# EAGLE schematic Atmega1284p (EAGLE 8.6.0)
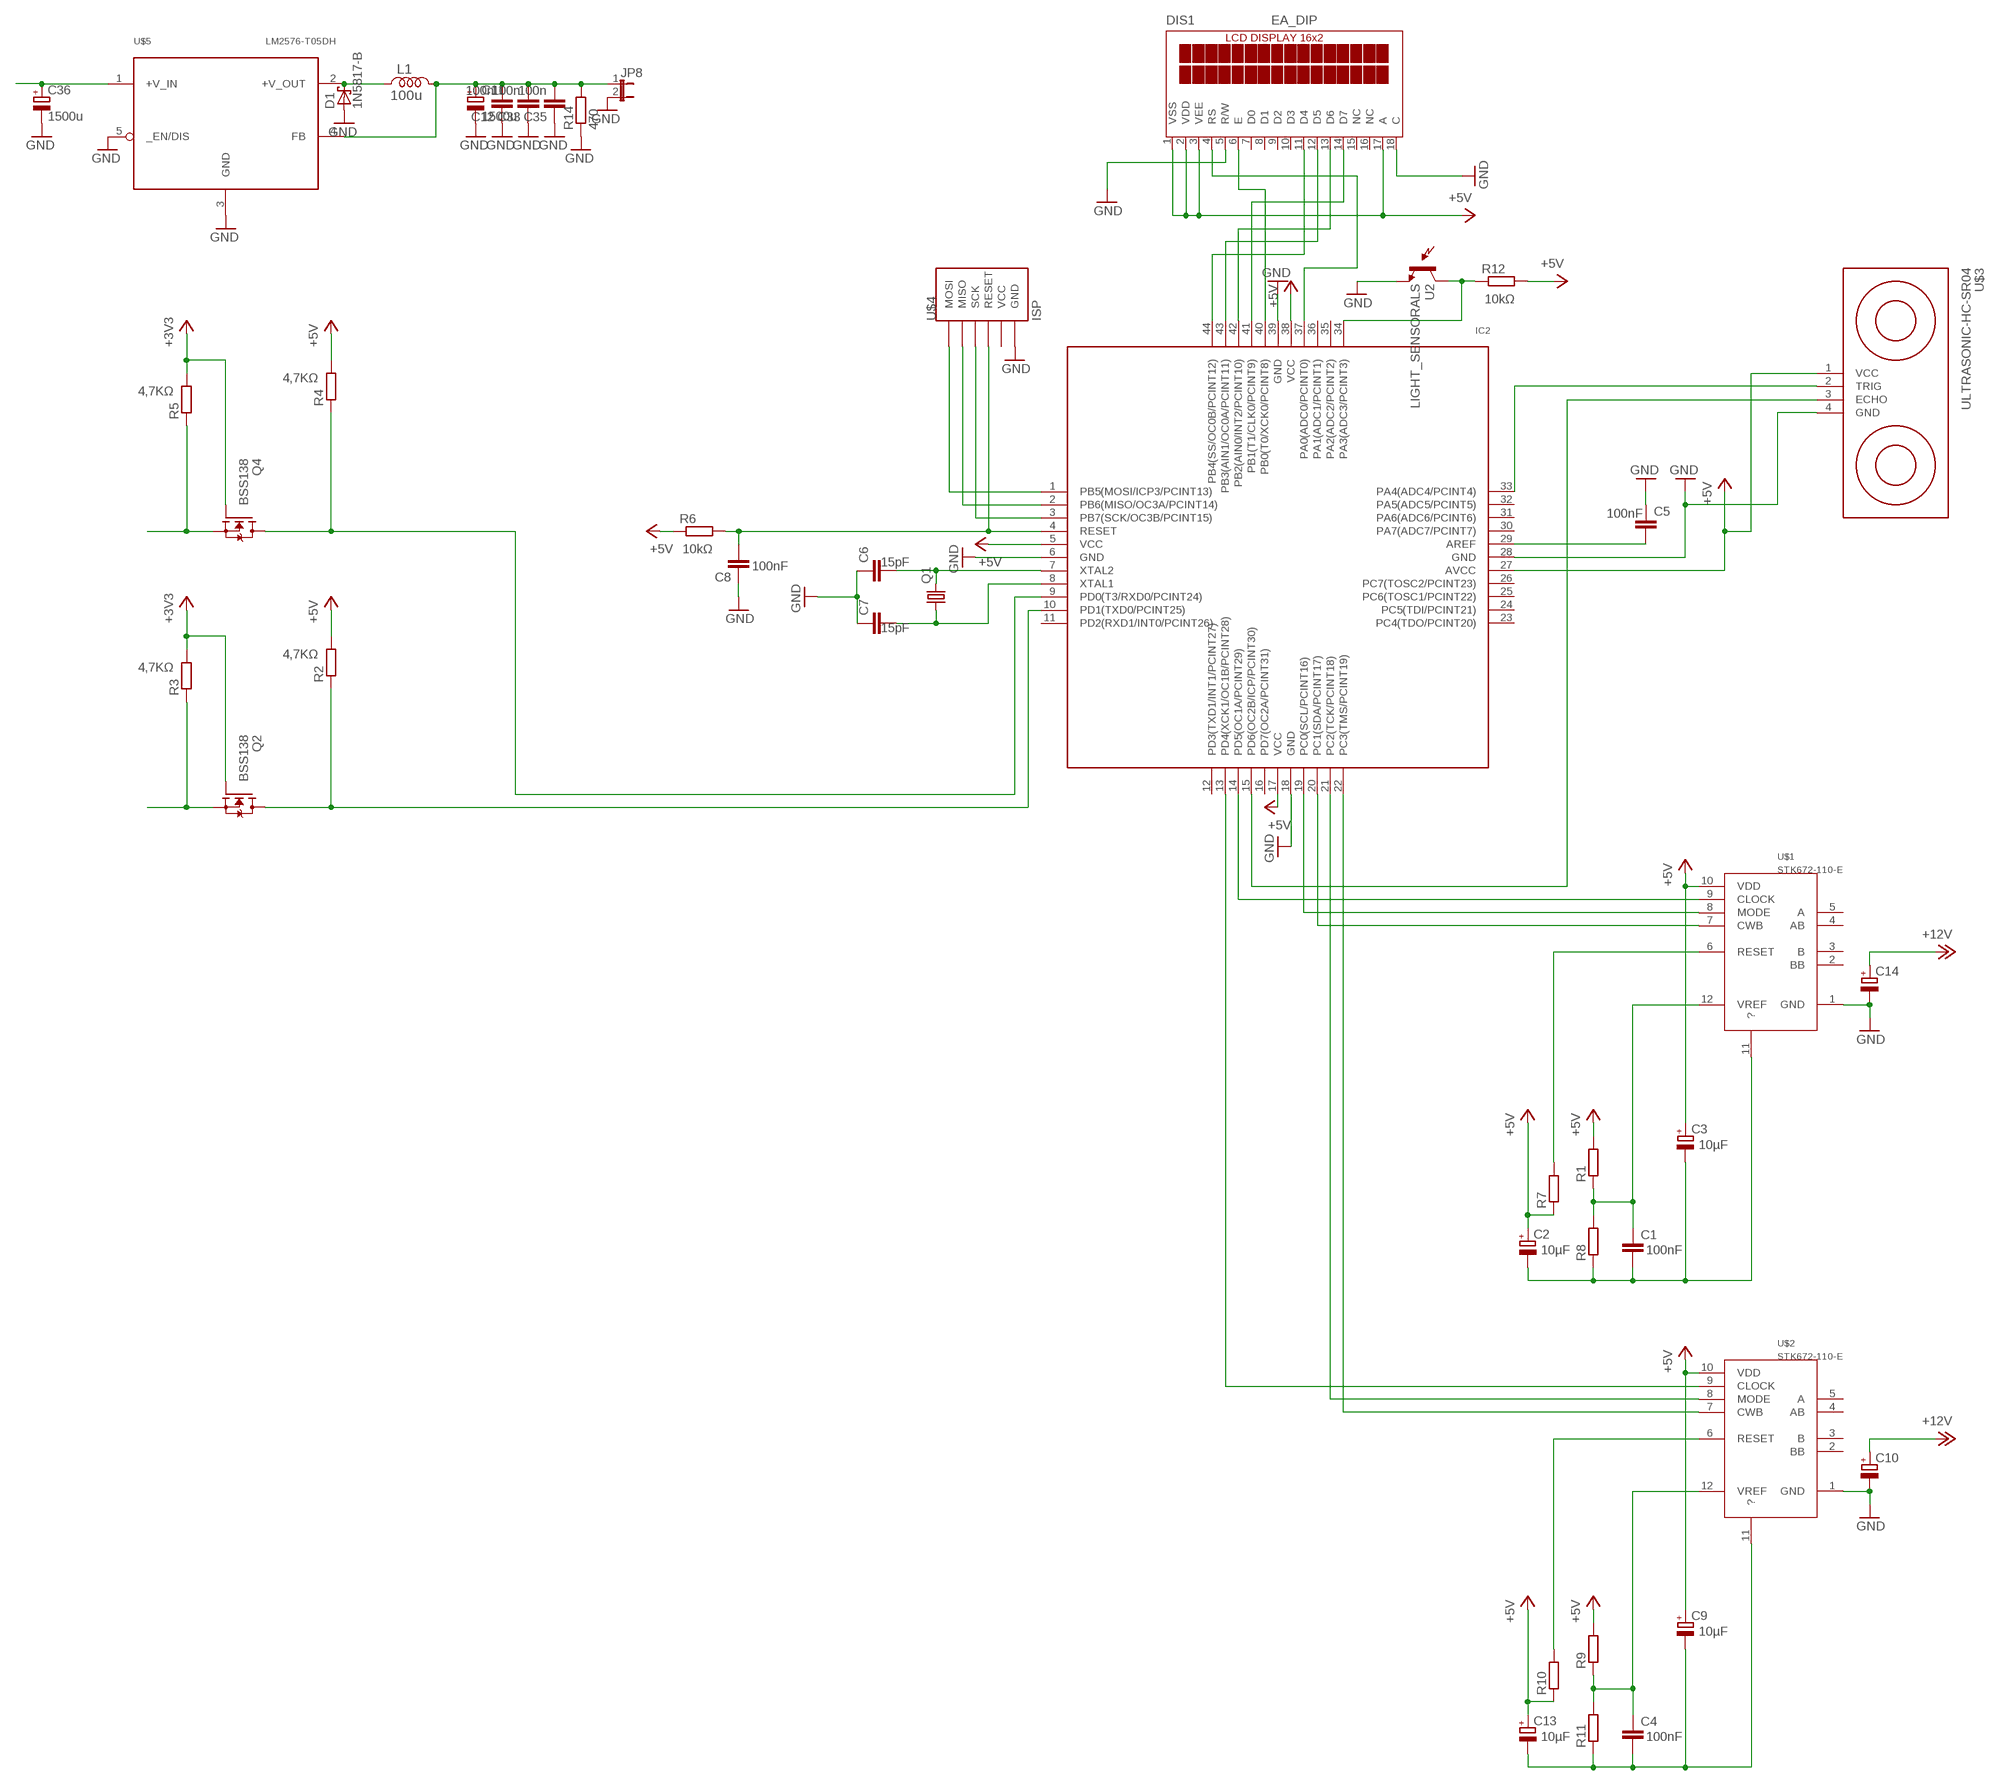
[diagram p0: schematic, sheet 1]

## Parts
C1  C-EUC0805  [C0805]
C2  CPOL-EUE2-5  [E2-5]
C3  CPOL-EUE2-5  [E2-5]
C4  C-EUC0805  [C0805]
C5  C-EUC0805  [C0805]
C6  C-EUC0805  [C0805]
C7  C-EUC0805  [C0805]
C8  C-EUC0805  [C0805]
C9  CPOL-EUE2-5  [E2-5]
C10  CPOL-EUE5-10.5  [E5-10,5]
C11  1500u  CPOL-EUE5-10.5  [E5-10,5]
C12  100n  C-EUC1206K  [C1206K]
C13  CPOL-EUE2-5  [E2-5]
C14  CPOL-EUE5-10.5  [E5-10,5]
C33  100n  C-EUC1206K  [C1206K]
C35  100n  C-EUC1206K  [C1206K]
C36  1500u  CPOL-EUE3.5-8  [E3,5-8]
D1  1N5817-B  [DO41-7.6]
DIS1  EA_DIP  [EA_DIP]
IC2  MEGA1284PSORT  [ATMEGA]
JP8  JP1E  [JP1]
L1  100u  COIL-HD  [RAD-60M-11M]
Q1  CRYSTALHC49S  [HC49/S]
Q2  BSS138  [SOT23]
Q4  BSS138  [SOT23]
R1  R-EU_R0805  [R0805]
R2  R-EU_R0805  [R0805]
R3  R-EU_R0805  [R0805]
R4  R-EU_R0805  [R0805]
R5  R-EU_R0805  [R0805]
R6  R-EU_R0805  [R0805]
R7  R-EU_R0805  [R0805]
R8  R-EU_R0805  [R0805]
R9  R-EU_R0805  [R0805]
R10  R-EU_R0805  [R0805]
R11  R-EU_R0805  [R0805]
R12  R-EU_R0805  [R0805]
R14  470  R-EU_R1206  [R1206]
U2  LIGHT_SENSORALS  [ALS-PT19]
U$1  STK672-110-E  [STK672-110-E]
U$2  STK672-110-E  [STK672-110-E]
U$3  ULTRASONIC-HC-SR04  [ULTRASONIC-HC-SR04]
U$4  ISP  [ISP]
U$5  LM2576-T05DH  [TO220512]

## Nets
+3V3: Q2.1(G) Q4.1(G) R3.2 R5.2
+5V: C2.+ C3.+ C9.+ C13.+ DIS1.1(VSS) DIS1.2(VDD) DIS1.3(VEE) DIS1.17(A) IC2.5(VCC) IC2.17(VCC) IC2.27(AVCC) IC2.38(VCC) R1.2 R2.2 R4.2 R6.1 R7.1 R9.2 R10.1 R12.2 U$1.10(VDD) U$2.10(VDD) U$3.1(VCC)
+12V: C10.+ C14.+
GND: C5.1 C6.1 C7.1 C8.1 C10.- C11.- C12.1 C14.- C33.1 C35.1 C36.- D1.A DIS1.5(R/W) DIS1.18(C) IC2.6(GND) IC2.18(GND) IC2.28(GND) IC2.39(GND) JP8.2 R14.1 U2.E(E1) U$2.1(GND) U$3.4(GND) U$4.GND U$5.3(GND) U$5.5(_EN/DIS)
N$1: IC2.14(PD5(OC1A/PCINT29)) U$1.9(CLOCK)
N$2: IC2.4(RESET) Q1.2 U$4.RESET
N$3: IC2.13(PD4(XCK1/OC1B/PCINT28)) U$2.9(CLOCK)
N$4: C1.1 R1.1 R8.2 U$1.12(VREF)
N$6: Q4.2(S) R5.1
N$7: Q2.2(S) R3.1
N$8: IC2.19(PC0(SCL/PCINT16)) U$1.8(MODE)
N$9: IC2.20(PC1(SDA/PCINT17)) U$1.7(CWB)
N$10: IC2.10(PD1(TXD0/PCINT25)) Q2.3(D) R2.1
N$11: C5.2 IC2.29(AREF)
N$12: C7.2 IC2.8(XTAL1) Q1.1
N$13: C6.2 IC2.7(XTAL2)
N$14: C8.2 R6.2
N$15: R7.2 U$1.6(RESET)
N$16: C1.2 C2.- C3.- R8.1 U$1.11(?)
N$17: C4.1 R9.1 R11.2 U$2.12(VREF)
N$18: R10.2 U$2.6(RESET)
N$19: C4.2 C9.- C13.- R11.1 U$2.11(?)
N$20: IC2.21(PC2(TCK/PCINT18)) U$2.8(MODE)
N$21: IC2.22(PC3(TMS/PCINT19)) U$2.7(CWB)
N$22: D1.C L1.1(L) U$5.2(+V_OUT)
N$23: C36.+ U$5.1(+V_IN)
N$25: IC2.1(PB5(MOSI/ICP3/PCINT13)) U$4.MOSI
N$26: IC2.2(PB6(MISO/OC3A/PCINT14)) U$4.MISO
N$27: IC2.3(PB7(SCK/OC3B/PCINT15)) U$4.SCK
N$28: DIS1.11(D4) IC2.44(PB4(SS/OC0B/PCINT12))
N$29: DIS1.12(D5) IC2.43(PB3(AIN1/OC0A/PCINT11))
N$30: DIS1.13(D6) IC2.42(PB2(AIN0/INT2/PCINT10))
N$31: DIS1.14(D7) IC2.41(PB1(T1/CLK0/PCINT9))
N$32: DIS1.6(E) IC2.40(PB0(T0/XCK0/PCINT8))
N$33: DIS1.4(RS) IC2.37(PA0(ADC0/PCINT0))
N$34: IC2.9(PD0(T3/RXD0/PCINT24)) Q4.3(D) R4.1
N$35: IC2.33(PA4(ADC4/PCINT4)) U$3.2(TRIG)
N$36: IC2.34(PA3(ADC3/PCINT3)) R12.1 U2.C(C1)
N$40: IC2.15(PD6(OC2B/ICP/PCINT30)) U$3.3(ECHO)
N$80: C11.+ C12.2 C33.2 C35.2 JP8.1 L1.2(R) R14.2 U$5.4(FB)
Unconnected: DIS1.7(D0) DIS1.8(D1) DIS1.9(D2) DIS1.10(D3) DIS1.15(NC) DIS1.16(NC) IC2.11(PD2(RXD1/INT0/PCINT26)) IC2.12(PD3(TXD1/INT1/PCINT27)) IC2.16(PD7(OC2A/PCINT31)) IC2.23(PC4(TDO/PCINT20)) IC2.24(PC5(TDI/PCINT21)) IC2.25(PC6(TOSC1/PCINT22)) IC2.26(PC7(TOSC2/PCINT23)) IC2.30(PA7(ADC7/PCINT7)) IC2.31(PA6(ADC6/PCINT6)) IC2.32(PA5(ADC5/PCINT5)) IC2.35(PA2(ADC2/PCINT2)) IC2.36(PA1(ADC1/PCINT1)) U$1.1(GND) U$1.2(BB) U$1.3(B) U$1.4(AB) U$1.5(A) U$2.2(BB) U$2.3(B) U$2.4(AB) U$2.5(A)

## Power pins joined to a net without a drawn wire
VCC: U$4.VCC

## Library data of the parts
C1 C4 = rcl:C-EU: CAPACITOR, European symbol; SPICEPREFIX: C; STK672-110-E: 100nF
C2 C3 C9 C13 = rcl:CPOL-EU: POLARIZED CAPACITOR, European symbol; SPICEPREFIX: 10µF
C5 = rcl:C-EU: CAPACITOR, European symbol; AREF: 100nF; SPICEPREFIX: C
C6 = rcl:C-EU: CAPACITOR, European symbol; SPICEPREFIX: C; XTAL1: 15pF
C7 = rcl:C-EU: CAPACITOR, European symbol; SPICEPREFIX: C; XTAL2: 15pF
C8 = rcl:C-EU: CAPACITOR, European symbol; RESET: 100nF; SPICEPREFIX: C
C10 C14 = rcl:CPOL-EU: POLARIZED CAPACITOR, European symbol; SPICEPREFIX: 100µF
C11 C36 = rcl:CPOL-EU: POLARIZED CAPACITOR, European symbol
C12 C33 C35 = rcl:C-EU: CAPACITOR, European symbol
D1 = _mod_diode:1N581*: 1.0A SCHOTTKY BARRIER RECTIFIER Source: http://www.diodes.com/datasheets/ds23001.pdf
DIS1 = display-lcd:EA_DIP: LCD-MODUL 2x16 - 6,68mm, INKL. KONTROLLER HD44780 Source: Data sheet <http://www.lcd-module.de/pdf/doma/dip162-d.pdf>
IC2 = Atmega1284pALL:MEGA1284PSORT: Atmel ATmega1284P 8-bit AVR Microcontroller
JP8 = jumper:JP1E: JUMPER
L1 = inductor:COIL-H: Inductor, horizontal; DESC: Inductor
Q1 = crystal:CRYSTAL: CRYSTAL; OC_FARNELL: 1667008; OC_NEWARK: unknown
Q2 Q4 = bss138_10:BSS138: BSS138 N-Channel Logic Level Enhancement Mode Field Effect Transistor Source: http://www.fairchildsemi.com/datasheets/BS/BSS138.pdf; MF: Fairchild; MPN: BSS138; OC_FARNELL: 9845330; OC_NEWARK: 67R2009
R1 R7-R11 = rcl:R-EU_: RESISTOR, European symbol; SPICEPREFIX: R
R2-R5 = rcl:R-EU_: RESISTOR, European symbol; R2: 4,7KΩ; SPICEPREFIX: R
R6 R12 = rcl:R-EU_: RESISTOR, European symbol; RESET: 10kΩ; SPICEPREFIX: R
R14 = rcl:R-EU_: RESISTOR, European symbol
U2 = SparkFun-Sensors:LIGHT_SENSOR: Ambient Light Sensors - Phototransistors Low cost ambient light sensors, consisting of a phototransistor in miniature SMD packages. Output voltage varies with light intensity. SparkFun Products ALS-PT19 Light Sensor <https://www.sparkfun.com/products/12566> (SEN-12566) Ambient Light Sensor - TEMT6000 <https://www.sparkfun.com/products/8348> (SEN-08348) SparkFun Ambient Light Sensor Breakout - TEMT60000 <https://www.sparkfun.com/products/8688> (SEN-08688); PROD_ID: IC-11836; SF_ID: SEN-12566
U$1 U$2 = STK672:STK672-110-E
U$3 = diy-modules:ULTRASONIC-HC-SR04: Ultrasonic Ranging Module HC-SR04 More details available here: http://randomnerdtutorials.com/complete-guide-for-ultrasonic-sensor-hc-sr04/ Click here to find device on ebay.com <http://www.ebay.com/sch/hc+sr04+ultrasonic>
U$4 = Library:ISP
U$5 = LM2576:LM2576-T05DH